# Altium schematic sheet Cover.SchDoc
size 420 x 297 mm; DrawnBy: Süleyman ARIKAYA; Revision: AA; SheetNumber: 1; SheetTotal: 5
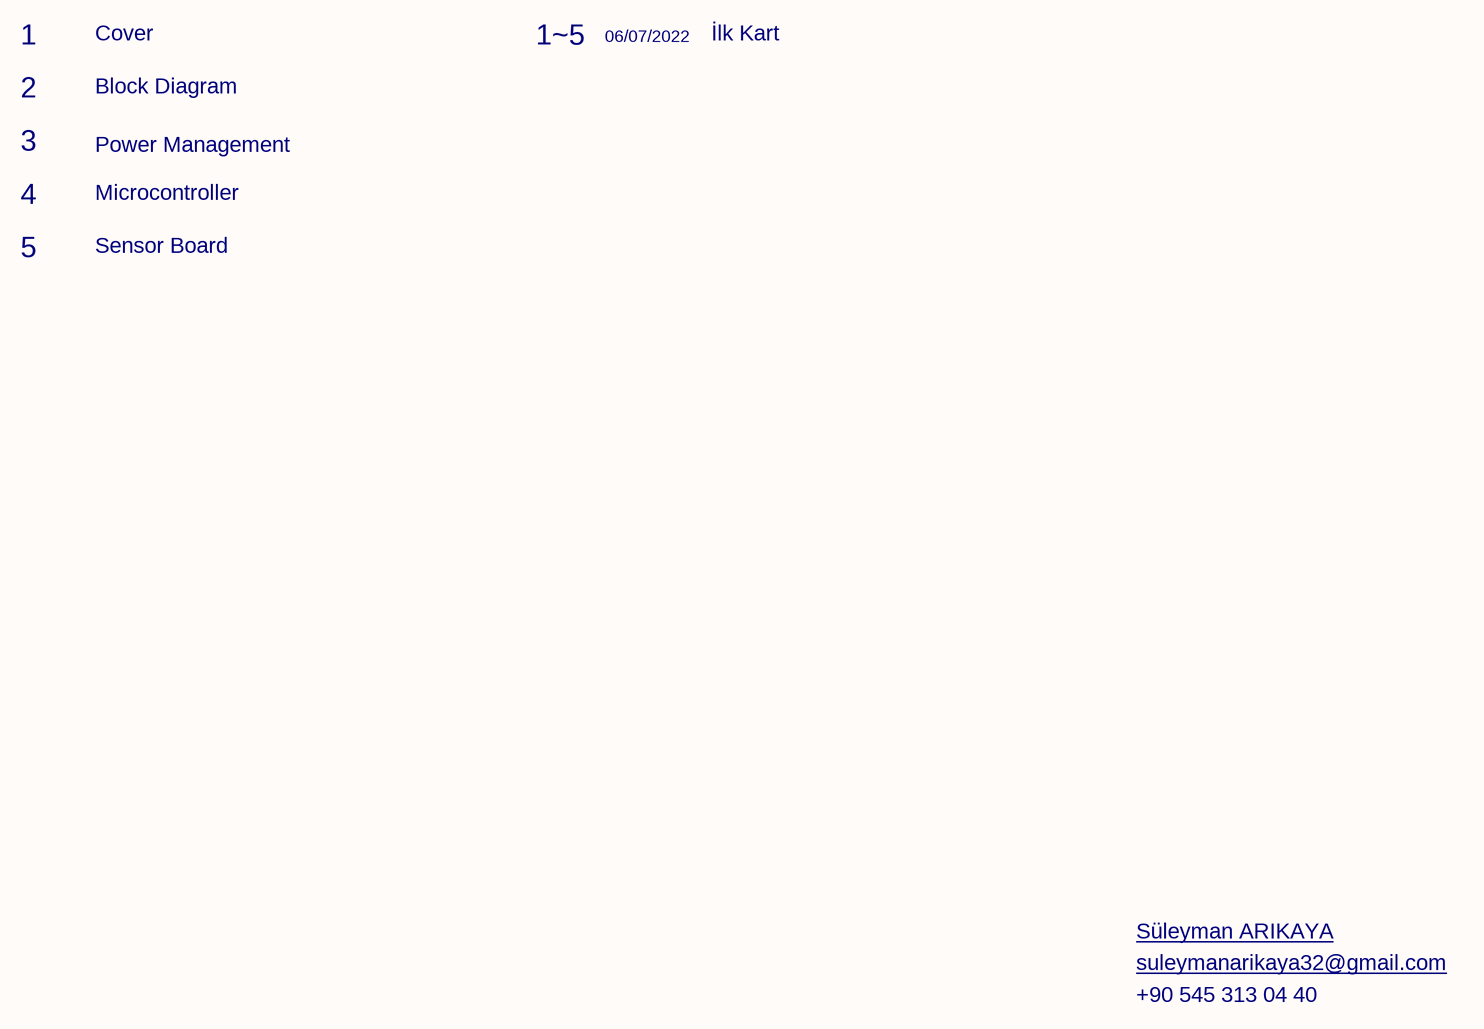
[diagram p0: Cover.SchDoc]

## Notes on the sheet
- 1
- Cover
- Block Diagram
- 1~5
- 06/07/2022
- İlk Kart
- 2
- 3
- Power Management
- 4
- Microcontroller
- 5
- Sensor Board
- Süleyman ARIKAYA <suleymanarikaya32@gmail.com>
- suleymanarikaya32@gmail.com
- +90 545 313 04 40
- İÇİNDEKİLER / CONTEXT
- REVİZYON / REVISION
- ÜRETİM NOTLARI / PRODUCTION NOTES
- Sayfa No
- Page No
- Açıklama / Description
- Tarih
- Date
- Kart Özellikleri
- Boartd Features
- Üretim Çıktıları
- Gerber Files
- Ekler
- Attachments
- İLETİŞİM / CONTACT
- TITLE:
- PROJECT:
- Size:
- A3
- Date:
- Rev:
- Drawn By:
- Süleyman ARIKAYA
- Sheet:
- of